# EAGLE design v1 (EAGLE 9.5.1)
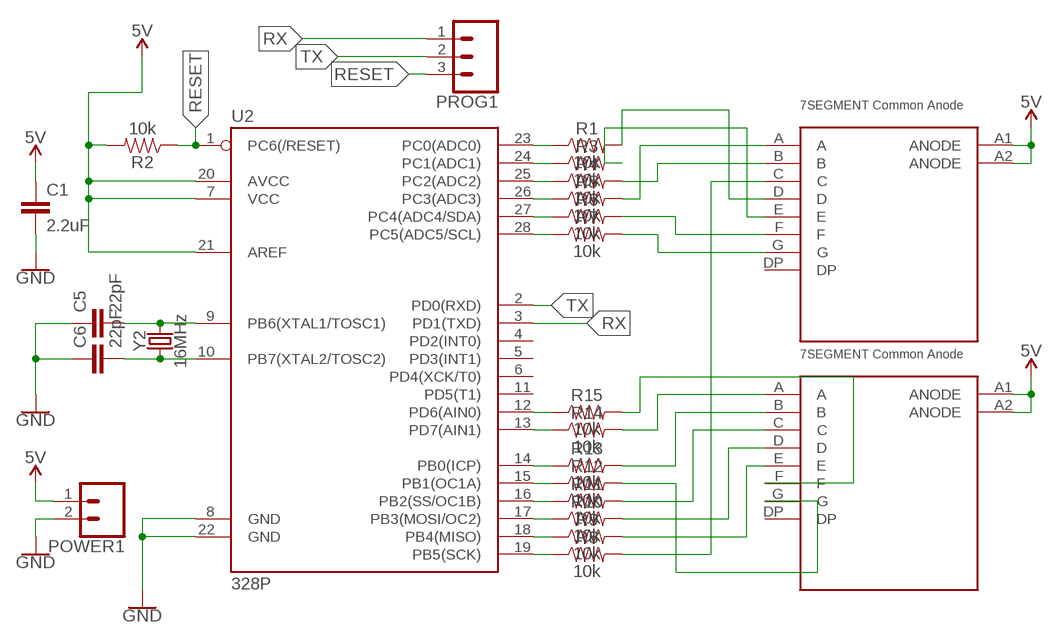
[diagram p0: schematic, sheet 1]

## Parts
C1  2.2uF  2.2UF-1206-50V-10%  [1206]
C5  22pF  22PF-PTH-2.54MM-200V-5%  [CAP-PTH-2.54]
C6  22pF  22PF-PTH-2.54MM-200V-5%  [CAP-PTH-2.54]
POWER1  CONN_02  [1X02]
PROG1  CONN_03  [1X03]
R1  10k  0.22OHM-0805-1/4W-1%  [0805]
R2  10k  1KOHM-HORIZ-1/4W-1%  [AXIAL-0.3]
R3  10k  0.22OHM-0805-1/4W-1%  [0805]
R4  10k  0.22OHM-0805-1/4W-1%  [0805]
R5  10k  0.22OHM-0805-1/4W-1%  [0805]
R6  10k  0.22OHM-0805-1/4W-1%  [0805]
R7  10k  0.22OHM-0805-1/4W-1%  [0805]
R8  10k  0.22OHM-0805-1/4W-1%  [0805]
R9  10k  0.22OHM-0805-1/4W-1%  [0805]
R10  10k  0.22OHM-0805-1/4W-1%  [0805]
R11  10k  0.22OHM-0805-1/4W-1%  [0805]
R12  10k  0.22OHM-0805-1/4W-1%  [0805]
R13  10k  0.22OHM-0805-1/4W-1%  [0805]
R14  10k  0.22OHM-0805-1/4W-1%  [0805]
R15  10k  0.22OHM-0805-1/4W-1%  [0805]
U2  328P  ATMEGA328P_PDIP  [DIP28]
U$1  7SEGMENTCA  [7SEGMENTCA]
U$2  7SEGMENTCA  [7SEGMENTCA]
Y2  16MHz  CRYSTAL-16MHZPTH-HC49US  [HC49US]

## Nets
5V: C1.1 POWER1.1 R2.P$2 U2.7(VCC) U2.20(AVCC) U2.21(AREF) U$1.A1(ANODE) U$1.A2(ANODE) U$2.A1(ANODE) U$2.A2(ANODE)
GND: C1.2 C5.1 C6.1 POWER1.2 U2.8(GND) U2.22(GND)
N$1: C5.2 U2.9(PB6(XTAL1/TOSC1)) Y2.2
N$2: C6.2 U2.10(PB7(XTAL2/TOSC2)) Y2.1
N$3: R1.1 U2.23(PC0(ADC0))
N$4: R3.1 U2.24(PC1(ADC1))
N$5: R4.1 U2.25(PC2(ADC2))
N$6: R5.1 U2.26(PC3(ADC3))
N$7: R6.1 U2.27(PC4(ADC4/SDA))
N$8: R7.1 U2.28(PC5(ADC5/SCL))
N$9: R7.2 U$1.G
N$10: R6.2 U$1.F
N$11: R5.2 U$1.A
N$12: R4.2 U$1.B
N$13: R3.2 U$1.E
N$14: R1.2 U$1.D
N$15: R8.1 U2.19(PB5(SCK))
N$16: R8.2 U$1.C
N$17: R12.1 U2.15(PB1(OC1A))
N$18: R11.1 U2.16(PB2(SS/OC1B))
N$19: R10.1 U2.17(PB3(MOSI/OC2))
N$20: R9.1 U2.18(PB4(MISO))
N$21: R9.2 U$2.E
N$22: R10.2 U$2.D
N$23: R11.2 U$2.C
N$24: R12.2 U$2.G
N$25: R15.1 U2.12(PD6(AIN0))
N$26: R14.1 U2.13(PD7(AIN1))
N$27: R13.1 U2.14(PB0(ICP))
N$28: R15.2 U$2.F
N$29: R14.2 U$2.A
N$30: R13.2 U$2.B
RESET: PROG1.3 R2.P$1 U2.1(PC6(/RESET))
RX: PROG1.1 U2.3(PD1(TXD))
TX: PROG1.2 U2.2(PD0(RXD))
Unconnected: U2.4(PD2(INT0)) U2.5(PD3(INT1)) U2.6(PD4(XCK/T0)) U2.11(PD5(T1)) U$1.DP U$2.DP

## Library data of the parts
C1 = SparkFun-Capacitors:2.2UF: 2.2µF ceramic capacitors A capacitor is a passive two-terminal electrical component used to store electrical energy temporarily in an electric field.; PROD_ID: CAP-10009
C5 C6 = SparkFun-Capacitors:22PF: 22pF ceramic capacitors A capacitor is a passive two-terminal electrical component used to store electrical energy temporarily in an electric field.; PROD_ID: CAP-09128
POWER1 = SparkFun-Connectors:CONN_02: Multi connection point. Often used as Generic Header-pin footprint for 0.1 inch spaced/style header connections On any of the 0.1 inch spaced packages, you can populate with these: Break Away Headers - Straight <https://www.sparkfun.com/products/116> (PRT-00116) Break Away Male Headers - Right Angle <https://www.sparkfun.com/products/553> (PRT-00553) Female Headers <https://www.sparkfun.com/products/115> (PRT-00115) Break Away Headers - Machine Pin <https://www.sparkfun.com/products/117> (PRT-00117) Break Away Female Headers - Swiss Machine Pin <https://www.sparkfun.com/products/743> (PRT-00743) For SCREWTERMINALS and SPRING TERMINALS visit here: Screw Terimnals on SparkFun.com <https://www.sparkfun.com/search/results?term=Screw+Terminals> (5mm/3.5mm/2.54mm spacing) This device is also useful as a general connection point to wire up your design to another part of your project. Our various solder wires solder well into these plated through hole pads. Hook-Up Wire - Assortment (Stranded, 22 AWG) <https://www.sparkfun.com/products/11375> (PRT-11375) Hook-Up Wire - Assortment (Solid Core, 22 AWG) <https://www.sparkfun.com/products/11367> (PRT-11367) View the entire wire category on our website here <https://www.sparkfun.com/categories/141> Special notes: Molex polarized connector foot print use with: PRT-08233 with associated crimp pins and housings. 2.54_SCREWTERM for use with PRT-10571. 3.5mm Screw Terminal footprints for PRT-08084 5mm Screw Terminal footprints for use with PRT-08432
PROG1 = SparkFun-Connectors:CONN_03: Multi connection point. Often used as Generic Header-pin footprint for 0.1 inch spaced/style header connections On any of the 0.1 inch spaced packages, you can populate with these: Break Away Headers - Straight <https://www.sparkfun.com/products/116> (PRT-00116) Break Away Male Headers - Right Angle <https://www.sparkfun.com/products/553> (PRT-00553) Female Headers <https://www.sparkfun.com/products/115> (PRT-00115) Break Away Headers - Machine Pin <https://www.sparkfun.com/products/117> (PRT-00117) Break Away Female Headers - Swiss Machine Pin <https://www.sparkfun.com/products/743> (PRT-00743) Stackable Header - 3 Pin (Female, 0.1") <https://www.sparkfun.com/products/13875> (PRT-13875) For SCREWTERMINALS and SPRING TERMINALS visit here: Screw Terimnals on SparkFun.com <https://www.sparkfun.com/search/results?term=Screw+Terminals> (5mm/3.5mm/2.54mm spacing) This device is also useful as a general connection point to wire up your design to another part of your project. Our various solder wires solder well into these plated through hole pads. Hook-Up Wire - Assortment (Stranded, 22 AWG) <https://www.sparkfun.com/products/11375> (PRT-11375) Hook-Up Wire - Assortment (Solid Core, 22 AWG) <https://www.sparkfun.com/products/11367> (PRT-11367) View the entire wire category on our website here <https://www.sparkfun.com/categories/141> Special notes: Molex polarized connector foot print use with SKU : PRT-08232 with associated crimp pins and housings.
R1 R3-R15 = SparkFun-Resistors:0.22OHM: 0.22Ω resistor A resistor is a passive two-terminal electrical component that implements electrical resistance as a circuit element. Resistors act to reduce current flow, and, at the same time, act to lower voltage levels within circuits. - Wikipedia; PROD_ID: RES-09883; VALUE: 0.22
R2 = SparkFun-Resistors:1KOHM: 1kΩ resistor A resistor is a passive two-terminal electrical component that implements electrical resistance as a circuit element. Resistors act to reduce current flow, and, at the same time, act to lower voltage levels within circuits. - Wikipedia; PROD_ID: RES-12182; VALUE: 1k
U2 = SparkFun-IC-Microcontroller:ATMEGA328P_PDIP: Atmel 328P Through hole ATMEGA328P uC used in the Arduino 32kb flash, 1k EEPROM, 2k SRAM Datasheet <http://www.sparkfun.com/datasheets/Components/SMD/ATMega328.pdf> SparkFun Products Storefront component: AVR 28 Pin 20MHz 32K 6A/D - ATMega328P <https://www.sparkfun.com/products/9061> (COM-09061) SparkFun Simon Says - Through-Hole Soldering Kit <https://www.sparkfun.com/products/10547> (KIT-10547) SparkFun Learn to Solder - Simon Says <https://www.sparkfun.com/products/13708> (KIT-13708) SparkFun BigTime Watch Kit <https://www.sparkfun.com/products/11734> (KIT-11734) SparkFun ClockIt <https://www.sparkfun.com/products/10930> (KIT-10930) SparkFun Serial Enabled LCD Kit <https://www.sparkfun.com/products/10097> (LCD-10097) SparkFun Simon Tilts - Through Hole Soldering Kit <https://www.sparkfun.com/products/12634> (KIT-12634) SparkFun Frequency Counter Kit <https://www.sparkfun.com/products/10140> (KIT-10140) FabFM Radio Kit <https://www.sparkfun.com/products/11043> (KIT-11043) SparkFun Binary Blaster Kit <https://www.sparkfun.com/products/12037> (KIT-12037) SparkFun Metro-Gnome <https://www.sparkfun.com/products/9236> (KIT-09236) ATmega328 with Arduino Optiboot (Uno) <https://www.sparkfun.com/products/10524> (DEV-10524); PROD_ID: IC-09136
U$1 U$2 = 7segmentca:7SEGMENTCA
Y2 = SparkFun-Clocks:CRYSTAL-16MHZ: 16MHz Crystal Digikey Example <http://www.digikey.com/product-search/en?keywords=535-9122-1-ND> Frequency: 16MHz Frequency Stability: ±50ppm Frequency Tolerance: ±20ppm Load Capacitance: 18pF SparkFun Products: Pro Micro -5V/16MHz <https://www.sparkfun.com/products/12640> SparkFun Serial Enabled LCD Kit <https://www.sparkfun.com/products/10097>; PROD_ID: XTAL-08181; SF_ID: COM-00536

## Board
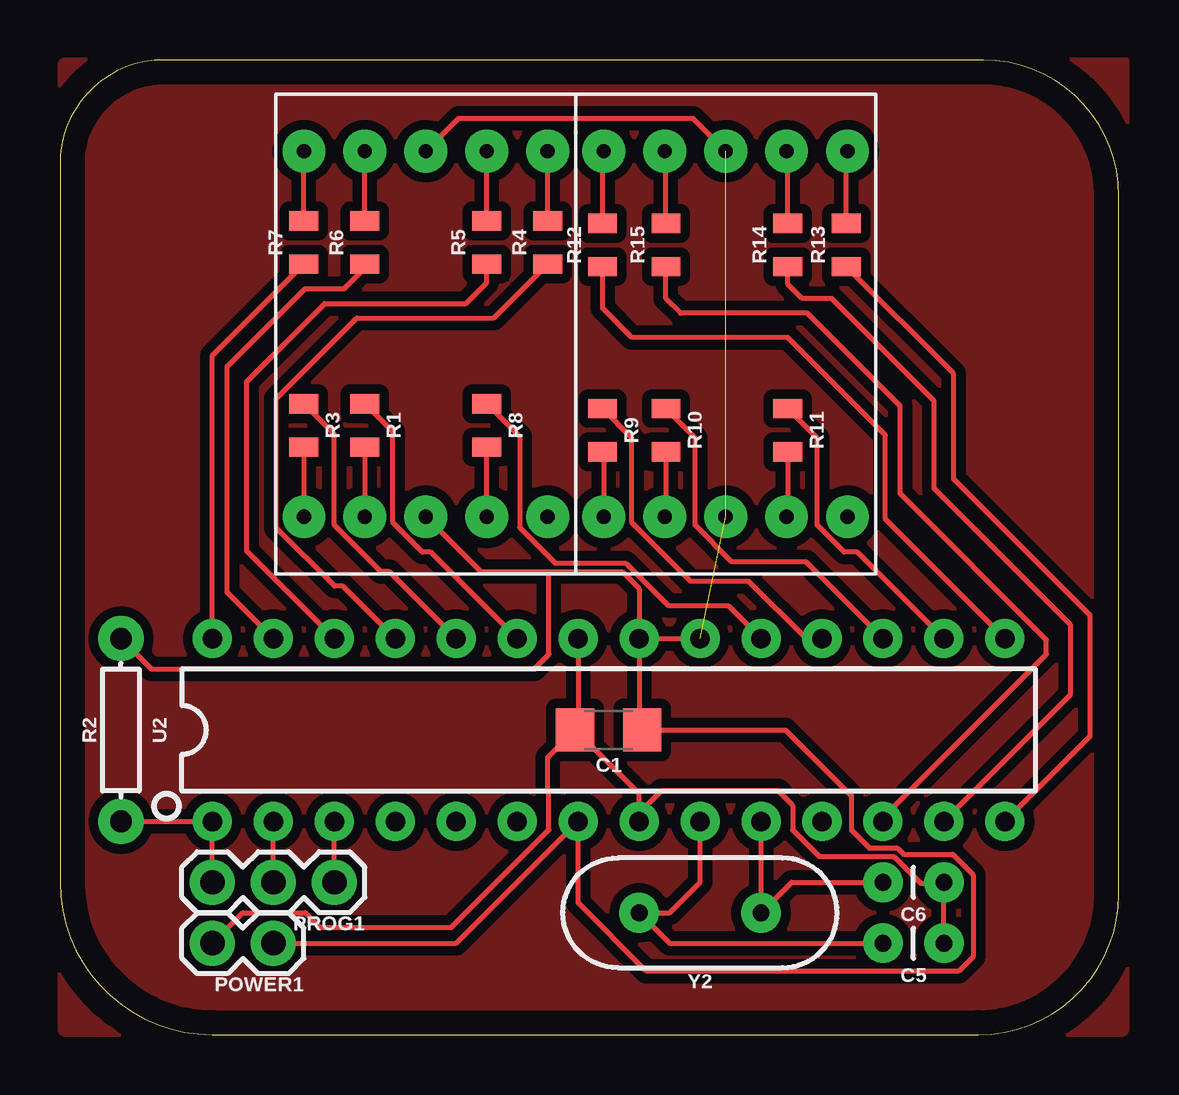
[diagram p1: board, top side]

Size 44.12 x 40.63 mm. Coordinates in mm from the lower left corner, seen from the top.
Outline: 0,36.31 0,6.35 arc90 6.35,0 38.27,0 arc90 44.12,5.85 44.12,34.98 arc90 38.47,40.63 4.32,40.63 arc90 0,36.31
Copper layers (1*16): Top 0.035mm / dielectric 1.5mm / Bottom 0.035mm
Design rules "default": minimum track width 6mil, minimum drill 0.35mm, track to track 6mil, track to pad 6mil, pad to pad 6mil, via to via 6mil, smd to smd 6mil, copper to edge 40mil, drill to drill 6mil, minimum pad ring 10mil, minimum via ring 8mil, stop-mask expansion 4mil, vias tented up to drill 0mil, thermal gap 10mil

### Footprints (pad centres in the part's own frame; a part is rotated, then mirrored left to right if it is on the bottom)
1206 = smd 1.6 x 1.8: 1 -1.4,0; 2 1.4,0
CAP-PTH-2.54 = drill 0.7 pad 1.651: 1 -1.27,0; 2 1.27,0
1X02 = drill 1.016 pad 1.88: 1 0,0; 2 2.54,0
1X03 = drill 1.016 pad 1.88: 1 0,0; 2 2.54,0; 3 5.08,0
0805 = smd 0.8 x 1.2: 1 -0.9,0; 2 0.9,0
AXIAL-0.3 = drill 0.9 pad 1.88: P$1 -3.81,0; P$2 3.81,0
DIP28 = drill 0.813 pad 1.626: 1 -16.51,-3.81; 2 -13.97,-3.81; 3 -11.43,-3.81; 4 -8.89,-3.81; 5 -6.35,-3.81; 6 -3.81,-3.81; 7 -1.27,-3.81; 8 1.27,-3.81; 9 3.81,-3.81; 10 6.35,-3.81; 11 8.89,-3.81; 12 11.43,-3.81; 13 13.97,-3.81; 14 16.51,-3.81; 15 16.51,3.81; 16 13.97,3.81; 17 11.43,3.81; 18 8.89,3.81; 19 6.35,3.81; 20 3.81,3.81; 21 1.27,3.81; 22 -1.27,3.81; 23 -3.81,3.81; 24 -6.35,3.81; 25 -8.89,3.81; 26 -11.43,3.81; 27 -13.97,3.81; 28 -16.51,3.81
7SEGMENTCA = drill 0.6 pad 1.778: A 2.54,7.62; A1 0,7.62; A2 0,-7.62; B 5.08,7.62; C 2.54,-7.62; D -2.54,-7.62; DP 5.08,-7.62; E -5.08,-7.62; F -2.54,7.62; G -5.08,7.62
HC49US = drill 0.7 pad 1.651: 1 -2.54,0; 2 2.54,0

### Placement (x,y rotation side)
C1  22.86,12.7 180 top
C5  35.56,3.81 180 top
C6  35.56,6.35 180 top
POWER1  8.89,3.81 180 top
PROG1  11.43,6.35 180 top
R1  12.7,25.4 270 top
R2  2.54,12.7 90 top
R3  10.16,25.4 270 top
R4  20.32,33.02 90 top
R5  17.78,33.02 90 top
R6  12.7,33.02 90 top
R7  10.16,33.02 90 top
R8  17.78,25.4 270 top
R9  22.61,25.2 270 top
R10  25.25,25.2 270 top
R11  30.33,25.2 270 top
R12  22.61,32.92 90 top
R13  32.77,32.92 90 top
R14  30.33,32.92 90 top
R15  25.25,32.92 90 top
U2  22.86,12.7 0 top
U$1  15.24,29.21 0 top
U$2  27.74,29.21 0 top
Y2  26.67,5.08 180 top

### Tracks (layer width: path | path; a pad name or v marks a point on that pad's centre or on a via)
5V  (2 unrouted)
  Top 0.203: U2.21 U2.20 | U$1.A2 17.53,19.3 20.37,19.3 | 20.37,19.3 23.42,19.3 24.13,18.59 U2.21 | R2.P$2 3.81,15.24 19.76,15.24 20.37,15.85 20.37,19.3 | U$1.A1 16.61,38.2 26.37,38.2 U$2.A1 | POWER1.1 16.51,3.81 U2.7 21.59,5.49 24.44,2.64 37.44,2.64 38.05,3.25 38.05,6.66 37.19,7.52 35.15,7.52 34.88,7.79 33.72,7.79 32.97,8.53 32.97,9.96 30.23,12.7 C1.1 24.13,12.83 U2.21
GND
  Top 0.203: C5.1 36.83,6.3 | 36.83,6.3 C6.1 | POWER1.2 7.62,5.08 10.21,5.08 10.82,4.47 16.31,4.47 20.37,8.53 20.37,10.11 20.32,10.16 20.32,11.56 C1.2 | 36.83,6.3 35.87,6.3 34.74,7.43 31.64,7.43 30.53,8.53 30.53,9.55 29.92,10.16 25.04,10.16 24.13,9.25 U2.8 24.13,10.03 C1.2 | U2.22 21.59,12.83 C1.2
N$1
  Top 0.203: U2.9 26.67,6.35 25.4,5.08 Y2.2 25.4,3.81 C5.2
N$2
  Top 0.203: U2.10 Y2.1 30.48,6.35 C6.2
N$3
  Top 0.203: U2.23 15.44,20.12 15.1,20.12 13.87,21.34 13.87,25.13 R1.1
N$4
  Top 0.203: U2.24 13.72,19.3 13.37,19.3 11.43,21.24 11.43,25.03 R3.1
N$5
  Top 0.203: U2.25 11.79,18.69 11.44,18.69 9.02,21.12 9.02,26.52 12.37,29.87 18.07,29.87 R4.1
N$6
  Top 0.203: U2.26 7.77,20.17 7.77,27.23 11.02,30.48 16.92,30.48 17.78,31.34 R5.1
N$7
  Top 0.203: U2.27 6.96,18.44 6.96,27.84 10.21,31.09 11.84,31.09 12.7,31.95 R6.1
N$8
  Top 0.203: U2.28 6.35,28.31 R7.1
N$9
  Top 0.203: R7.2 U$1.G
N$10
  Top 0.203: R6.2 U$1.F
N$11
  Top 0.203: R5.2 U$1.A
N$12
  Top 0.203: R4.2 U$1.B
N$13
  Top 0.203: R3.2 U$1.E
N$14
  Top 0.203: R1.2 U$1.D
N$15
  Top 0.203: R8.1 19.15,24.93 19.15,21.14 20.63,19.66 23.57,19.66 25.34,17.88 27.84,17.88 U2.19
N$16
  Top 0.203: U$1.C R8.2
N$17
  Top 0.203: U2.15 34.39,21.49 34.39,24.99 30.33,29.06 23.83,29.06 22.61,30.28 R12.1
N$18
  Top 0.203: U2.16 33.22,20.12 32.67,20.12 31.55,21.24 31.55,24.88 R11.1
N$19
  Top 0.203: U2.17 31.09,19.71 28,19.71 26.47,21.24 26.47,24.88 R10.1
N$20
  Top 0.203: U2.18 31.09,16.51 28.7,18.9 26.27,18.9 23.83,21.34 23.83,24.88 R9.1
N$21
  Top 0.203: R9.2 22.66,24.25 U$2.E
N$22
  Top 0.203: R10.2 25.25,21.64 U$2.D
N$23
  Top 0.203: R11.2 30.33,21.64 U$2.C
N$24
  Top 0.203: R12.2 22.61,36.78 U$2.G
N$25
  Top 0.203: U2.12 34.29,9.04 41.1,15.85 41.1,16.46 35,22.55 35,26.21 31.14,30.07 25.86,30.07 25.25,30.68 R15.1
N$26
  Top 0.203: U2.13 42.11,14.17 42.11,17.07 36.42,22.76 36.42,26.42 32.16,30.68 30.94,30.68 30.33,31.29 R14.1
N$27
  Top 0.203: U2.14 42.93,12.45 42.93,17.48 37.24,23.16 37.24,27.55 R13.1
N$28
  Top 0.203: R15.2 25.25,36.78 U$2.F
N$29
  Top 0.203: R14.2 30.33,36.78 U$2.A
N$30
  Top 0.203: R13.2 32.77,36.78 U$2.B
NEW
  pour Top (isolate 0.406): 44.2,0 0.25,0 arc-90 0,0.25 0,40.39 arc-90 0.25,40.64 44.45,40.64 44.45,0.25 arc-90
RESET
  Top 0.203: R2.P$1 U2.1 PROG1.3
RX
  Top 0.203: PROG1.1 U2.3
TX
  Top 0.203: PROG1.2 U2.2